# EAGLE schematic timetracker-1-1 (EAGLE 7.5.0)
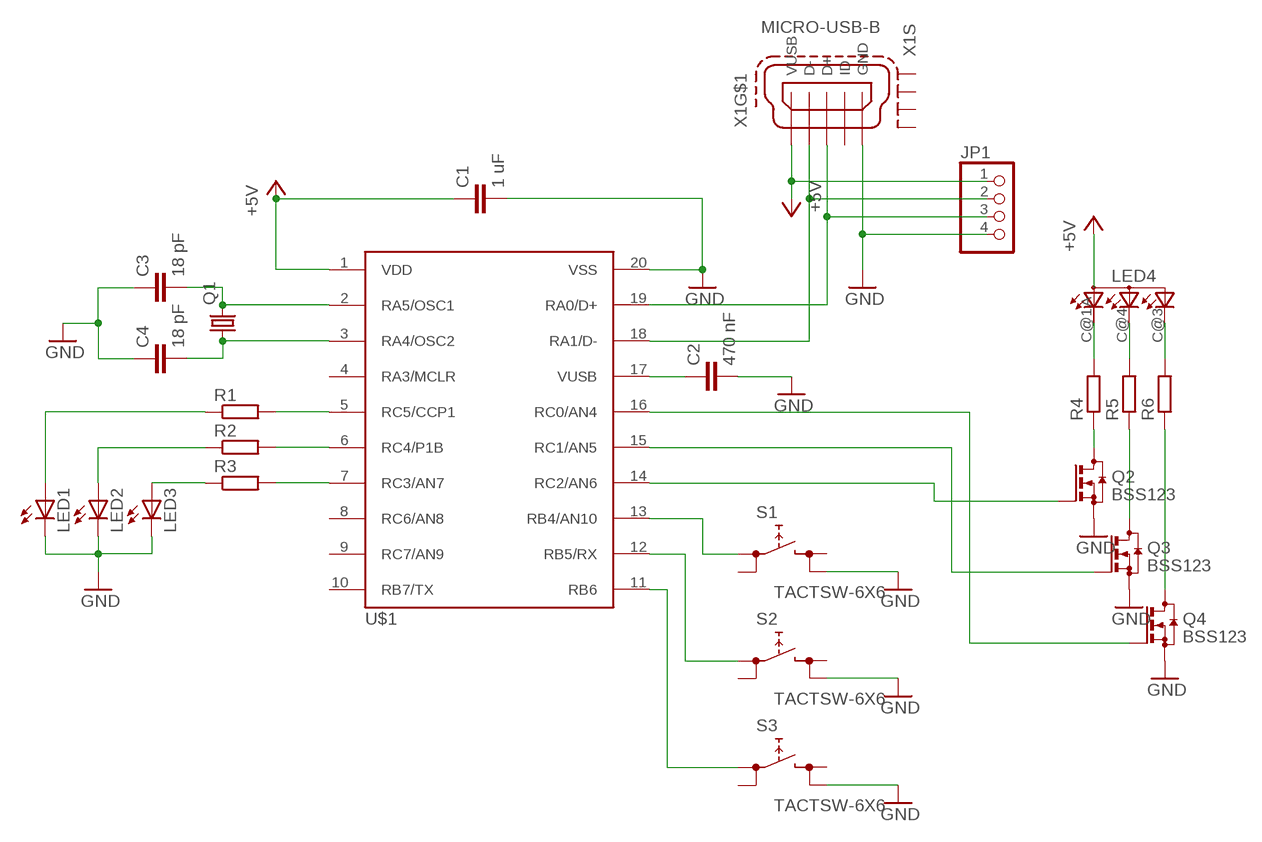
[diagram p0: schematic, sheet 1]

## Parts
C1  1 uF  C-EUC0805  [C0805]
C2  470 nF  C-EUC0805  [C0805]
C3  18 pF  C-EUC0805  [C0805]
C4  18 pF  C-EUC0805  [C0805]
JP1  PINHD-1X4  [1X04]
LED1  LEDSML0805  [SML0805]
LED2  LEDSML0805  [SML0805]
LED3  LEDSML0805  [SML0805]
LED4  RGBLED-3P-LCC-4  [P-LCC-4]
Q1  CRYSTALHC49UP  [HC49UP]
Q2  BSS123  [SOT23]
Q3  BSS123  [SOT23]
Q4  BSS123  [SOT23]
R1  R-EU_R0805  [R0805]
R2  R-EU_R0805  [R0805]
R3  R-EU_R0805  [R0805]
R4  R-EU_R0805  [R0805]
R5  R-EU_R0805  [R0805]
R6  R-EU_R0805  [R0805]
S1  TACTSW-6X6  [TACTSW-6X6]
S2  TACTSW-6X6  [TACTSW-6X6]
S3  TACTSW-6X6  [TACTSW-6X6]
U$1  PIC18F14K50  [DIL20]
X1  MICRO-USB-B  [MICRO-B-PAC]

## Nets
+5V: C1.1 JP1.1 LED4.A(A2) U$1.1(VDD) X1.1(VUSB)
GND: C1.2 C2.2 C3.1 C4.1 JP1.4 LED1.C LED2.C LED3.C Q2.2(S) Q3.2(S) Q4.2(S) S1.4(2.2) S2.4(2.2) S3.4(2.2) U$1.20(VSS) X1.5(GND)
N$1: JP1.3 U$1.19(RA0/D+) X1.3(D+)
N$2: C3.2 Q1.2 U$1.2(RA5/OSC1)
N$3: C2.1 U$1.17(VUSB)
N$4: C4.2 Q1.1 U$1.3(RA4/OSC2)
N$5: JP1.2 U$1.18(RA1/D-) X1.2(D-)
N$6: R3.2 U$1.7(RC3/AN7)
N$7: R2.2 U$1.6(RC4/P1B)
N$8: R1.2 U$1.5(RC5/CCP1)
N$9: LED1.A R1.1
N$10: LED2.A R2.1
N$11: LED3.A R3.1
N$12: LED4.C@1(CRED) R4.2
N$13: LED4.C@4(CGREEN) R5.2
N$14: S1.1(1.1) U$1.13(RB4/AN10)
N$15: S2.1(1.1) U$1.12(RB5/RX)
N$16: LED4.C@3(CBLUE) R6.2
N$17: Q2.3(D) R4.1
N$18: Q3.3(D) R5.1
N$19: Q4.3(D) R6.1
N$20: Q4.1(G) U$1.16(RC0/AN4)
N$21: Q3.1(G) U$1.15(RC1/AN5)
N$22: Q2.1(G) U$1.14(RC2/AN6)
N$23: S3.1(1.1) U$1.11(RB6)
Unconnected: S1.2(1.2) S1.3(2.1) S2.2(1.2) S2.3(2.1) S3.2(1.2) S3.3(2.1) U$1.4(RA3/MCLR) U$1.8(RC6/AN8) U$1.9(RC7/AN9) U$1.10(RB7/TX) X1.4(ID) X1.M1(S:S1) X1.M2(S:S2) X1.M3(S:S3) X1.M4(S:S4)

## Library data of the parts
C1-C4 = rcl:C-EU: CAPACITOR, European symbol
JP1 = pinhead:PINHD-1X4: PIN HEADER
LED1-LED3 = led:LED: LED OSRAM: - CHIPLED LG R971, LG N971, LY N971, LG Q971, LY Q971, LO R971, LY R971 LH N974, LH R974 LS Q976, LO Q976, LY Q976 LO Q996 - Hyper CHIPLED LW Q18S LB Q993, LB Q99A, LB R99A - SideLED LS A670, LO A670, LY A670, LG A670, LP A670 LB A673, LV A673, LT A673, LW A673 LH A674 LY A675 LS A676, LA A676, LO A676, LY A676, LW A676 LS A679, LY A679, LG A679 - Hyper Micro SIDELED® LS Y876, LA Y876, LO Y876, LY Y876 LT Y87S - SmartLED LW L88C, LW L88S LB L89C, LB L89S, LG L890 LS L89K, LO L89K, LY L89K LS L896, LA L896, LO L896, LY L896 - TOPLED LS T670, LO T670, LY T670, LG T670, LP T670 LSG T670, LSP T670, LSY T670, LOP T670, LYG T670 LG T671, LOG T671, LSG T671 LB T673, LV T673, LT T673, LW T673 LH T674 LS T676, LA T676, LO T676, LY T676, LB T676, LH T676, LSB T676, LW T676 LB T67C, LV T67C, LT T67C, LS T67K, LO T67K, LY T67K, LW E67C LS E67B, LA E67B, LO E67B, LY E67B, LB E67C, LV E67C, LT E67C LW T67C LS T679, LY T679, LG T679 LS T770, LO T770, LY T770, LG T770, LP T770 LB T773, LV T773, LT T773, LW T773 LH T774 LS E675, LA E675, LY E675, LS T675 LS T776, LA T776, LO T776, LY T776, LB T776 LHGB T686 LT T68C, LB T68C - Hyper Mini TOPLED® LB M676 - Mini TOPLED Santana® LG M470 LS M47K, LO M47K, LY M47K Source: http://www.osram.convergy.de LUXEON: - LUMILED® LXK2-PW12-R00, LXK2-PW12-S00, LXK2-PW14-U00, LXK2-PW14-V00 LXK2-PM12-R00, LXK2-PM12-S00, LXK2-PM14-U00 LXK2-PE12-Q00, LXK2-PE12-R00, LXK2-PE12-S00, LXK2-PE14-T00, LXK2-PE14-U00 LXK2-PB12-K00, LXK2-PB12-L00, LXK2-PB12-M00, LXK2-PB14-N00, LXK2-PB14-P00, LXK2-PB14-Q00 LXK2-PR12-L00, LXK2-PR12-M00, LXK2-PR14-Q00, LXK2-PR14-R00 LXK2-PD12-Q00, LXK2-PD12-R00, LXK2-PD12-S00 LXK2-PH12-R00, LXK2-PH12-S00 LXK2-PL12-P00, LXK2-PL12-Q00, LXK2-PL12-R00 Source: www.luxeon.com KINGBRIGHT: KA-3528ASYC Source: www.kingbright.com
LED4 = g-e2e-training:RGBLED-3: OSRAM - Hyper Multi TOPLED® (RGB) LB E673, LV E673, LT E673 - Power TOPLED® Enhanced optical Power LED (HOP2000) LS E67B, LA E67B, LO E67B, LY E67B - Hyper Multi TOPLED® Enhanced optical Power LED (HOP2000 / ATON®) LATB T66B - Hyper Multi TOPLED® Hyper-Bright LED LATB T686 Source: http://www.osram.convergy.de/
Q1 = g-e2e-training:CRYSTAL: CRYSTAL; OC_FARNELL: unknown; OC_NEWARK: unknown
Q2-Q4 = transistor-small-signal:BSS123: N-CHANNEL MOS FET
R1-R6 = rcl:R-EU_: RESISTOR, European symbol
S1-S3 = g-e2e-training:TACTSW-6X6: 6.2 X 6.5mm TACT Switch (SMD) Source: http://www3.alps.co.jp/WebObjects/catalog.woa/PDF/E/Switch/Tact/SKHM/SKHM.PDF
U$1 = pic18f14k50:PIC18F14K50
X1 = g-e2e-training:MICRO-USB-B: MINI USB-B Conector Source: www.cypressindustries.com